# EAGLE design HabDroneSCHCO2 (EAGLE 8.3.1)
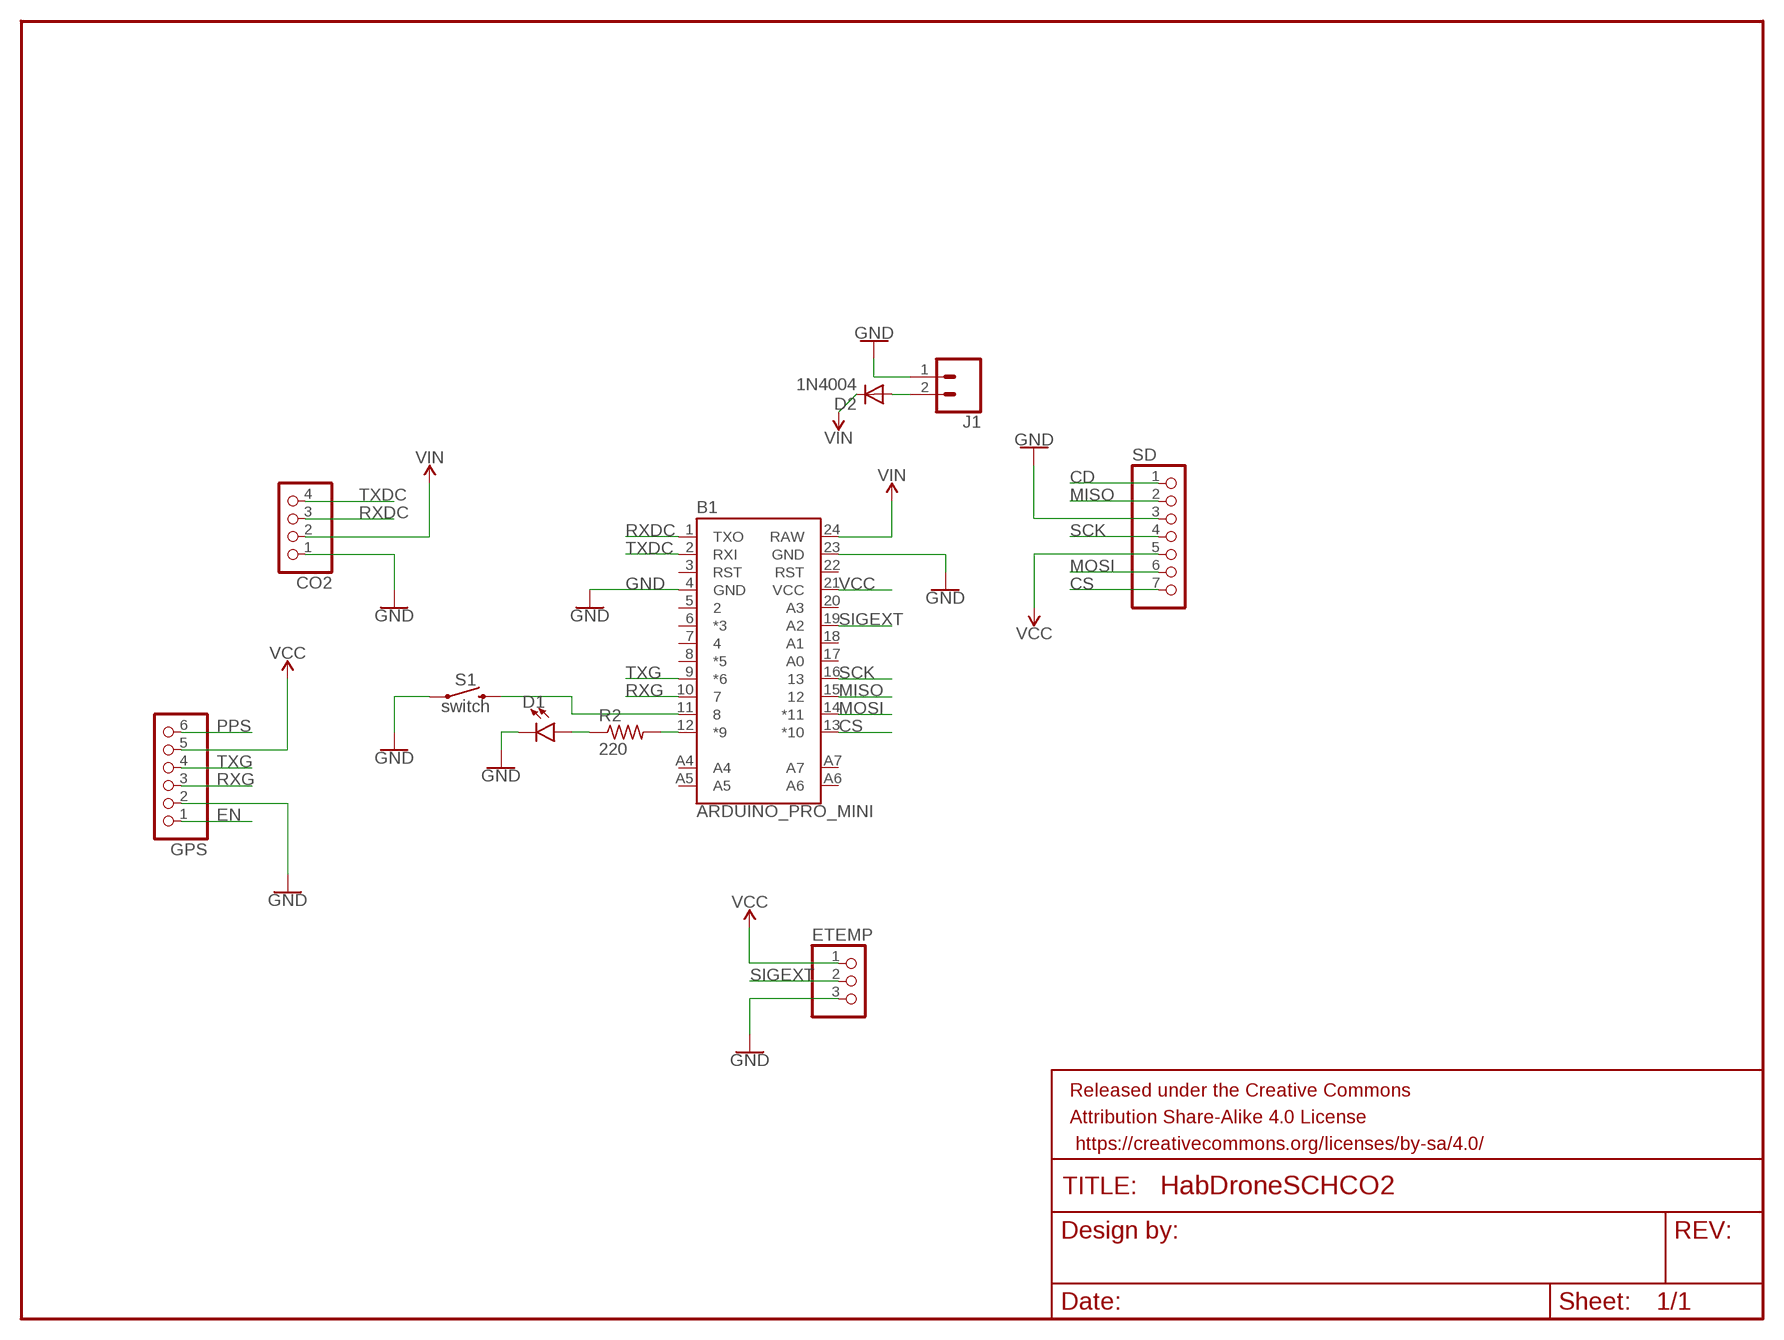
[diagram p0: schematic, sheet 1]

## Parts
B1  ARDUINO_PRO_MINI  [ARDUINO_PRO_MINI]
CO2  PINHD-1X4/90  [1X04/90]
D1  LED5MM  [LED_5MM]
D2  1N4004  [DO41-10]
ETEMP  PINHD-1X3/90  [1X03/90]
FRAME1  FRAME-LETTERNO_PACKAGE  [DUMMY]
GPS  PINHD-1X6/90  [1X06/90]
J1  CONN_025MM  [SCREWTERMINAL-5MM-2]
R2  220  R-US_VMTA55  [VMTA55]
S1  switch  MOMENTARY-SWITCH-SPST-PTH-6.0MM  [TACTILE_SWITCH_PTH_6.0MM]
SD  PINHD-1X7/90  [1X07/90]

## Nets
CD: SD.1
CS: B1.13(*10) SD.7
EN: GPS.1
GND: B1.4(GND) B1.23(GND) CO2.1 D1.K(C) ETEMP.3 GPS.2 J1.1 S1.1 SD.3
MISO: B1.15 SD.2
MOSI: B1.14(*11) SD.6
N$1: D2.A J1.2
N$2: B1.11 S1.3
N$5: B1.12(*9) R2.2
N$6: D1.A R2.1
PPS: GPS.6
RXDC: B1.1(TXO) CO2.3
RXG: B1.10 GPS.3
SCK: B1.16 SD.4
SIGEXT: B1.19(A2) ETEMP.2
TXDC: B1.2(RXI) CO2.4
TXG: B1.9(*6) GPS.4
VCC: B1.21(VCC) ETEMP.1 GPS.5 SD.5
VIN: B1.24(RAW) CO2.2 D2.C
Unconnected: B1.3(RST) B1.5 B1.6(*3) B1.7 B1.8(*5) B1.17(A0) B1.18(A1) B1.20(A3) B1.22(RST) B1.A4 B1.A5 B1.A6 B1.A7

## Library data of the parts
B1 = SparkFun-Boards:ARDUINO_PRO_MINI: SparkFun Pro Mini Pro Mini compatible footprint. Dimensions: 0.7 x 1.3" PCB Thickness: 0.8mm SparkFun Products: 3.3V/8MHz <https://www.sparkfun.com/products/11114> 5V/16MHz <https://www.sparkfun.com/products/11113>
CO2 = pinhead:PINHD-1X4: PIN HEADER
D1 = SparkFun-LED:LED: LED (Generic) Standard schematic elements and footprints for 5mm, 3mm, 1206, and 0603 sized LEDs. Generic LEDs with no color specified.
D2 = diode:1N4004: DIODE general purpose rectifier, 1 A
ETEMP = pinhead:PINHD-1X3: PIN HEADER
FRAME1 = SparkFun-Aesthetics:FRAME-LETTER: Schematic Frame - Letter Standard 8.5x11 US Letter frame; DESIGNER: Nobody; VERSION: v01
GPS = pinhead:PINHD-1X6: PIN HEADER
J1 = SparkFun-Retired:CONN_02: Multi connection point. Often used as Generic Header-pin footprint for 0.1 inch spaced/style header connections On any of the 0.1 inch spaced packages, you can populate with these: Break Away Headers - Straight <https://www.sparkfun.com/products/116> (PRT-00116) Break Away Male Headers - Right Angle <https://www.sparkfun.com/products/553> (PRT-00553) Female Headers <https://www.sparkfun.com/products/115> (PRT-00115) Break Away Headers - Machine Pin <https://www.sparkfun.com/products/117> (PRT-00117) Break Away Female Headers - Swiss Machine Pin <https://www.sparkfun.com/products/743> (PRT-00743) For SCREWTERMINALS and SPRING TERMINALS visit here: Screw Terimnals on SparkFun.com <https://www.sparkfun.com/search/results?term=Screw+Terminals> (5mm/3.5mm/2.54mm spacing) This device is also useful as a general connection point to wire up your design to another part of your project. Our various solder wires solder well into these plated through hole pads. Hook-Up Wire - Assortment (Stranded, 22 AWG) <https://www.sparkfun.com/products/11375> (PRT-11375) Hook-Up Wire - Assortment (Solid Core, 22 AWG) <https://www.sparkfun.com/products/11367> (PRT-11367) View the entire wire category on our website here <https://www.sparkfun.com/categories/141> Special notes: Molex polarized connector foot print use with: PRT-08233 with associated crimp pins and housings. 2.54_SCREWTERM for use with PRT-10571. 3.5mm Screw Terminal footprints for PRT-08084 5mm Screw Terminal footprints for use with PRT-08432; SF_SKU: PRT-08432
R2 = rcl:R-US_: RESISTOR, American symbol
S1 = SparkFun-Switches:MOMENTARY-SWITCH-SPST: Momentary Switch (Pushbutton) - SPST Normally-open (NO) SPST momentary switches (buttons, pushbuttons). Variants PTH-12MM - 12mm square, through-hole Momentary Pushbutton Switch - 12mm Square <https://www.sparkfun.com/products/9190> (COM-09190) PTH-6.0MM, PTH-6.0MM-KIT - 6.0mm square, through-hole Mini Pushbutton Switch <https://www.sparkfun.com/products/97> (COM-00097) KIT package intended for soldering kit's - only one side of pads' copper is exposed. PTH-RIGHT-ANGLE-KIT - Right-angle, through-hole Right Angle Tactile Button <https://www.sparkfun.com/products/10791> - Used on SparkFun BigTime Watch Kit <https://www.sparkfun.com/products/11734> SMD-12MM - 12mm square, surface-mount Tactile Button - SMD (12mm) <https://www.sparkfun.com/products/12993> (COM-12993) Used on SparkFun PicoBoard <https://www.sparkfun.com/products/11888> SMD-4.5MM - 4.5mm Square Trackball Switch Used on SparkFun Blackberry Trackballer Breakout <https://www.sparkfun.com/products/13169> SMD-4.6MMX2.8MM - 4.60mm x 2.80mm, surface mount Used on SparkFun SAMD21 Mini Breakout <https://www.sparkfun.com/products/13664> SMD-5.2MM, SMD-5.2-REDUNDANT - 5.2mm square, surface-mount Mini Pushbutton Switch - SMD <https://www.sparkfun.com/products/8720> (COM-08720) Used on Arduino Pro Mini <https://www.sparkfun.com/products/11114> REDUNDANT package connects both switch circuits together SMD-6.0X3.5MM - 6.0 x 3.5mm, surface mount Momentary Reset Switch SMD <https://www.sparkfun.com/products/8229> (COM-08229) SMD-6.2MM-TALL - 6.2mm square, surface mount Tactile Button - SMD (6mm) <https://www.sparkfun.com/products/12992> Used on SparkFun Digital Sandbox <https://www.sparkfun.com/products/12651> SMD-RIGHT-ANGLE - Right-angle, surface mount Used on SparkFun Block for Intel® Edison - Arduino <https://www.sparkfun.com/products/13036>; PROD_ID: SWCH-08441; SF_SKU: COM-00097
SD = pinhead:PINHD-1X7: PIN HEADER

## Board
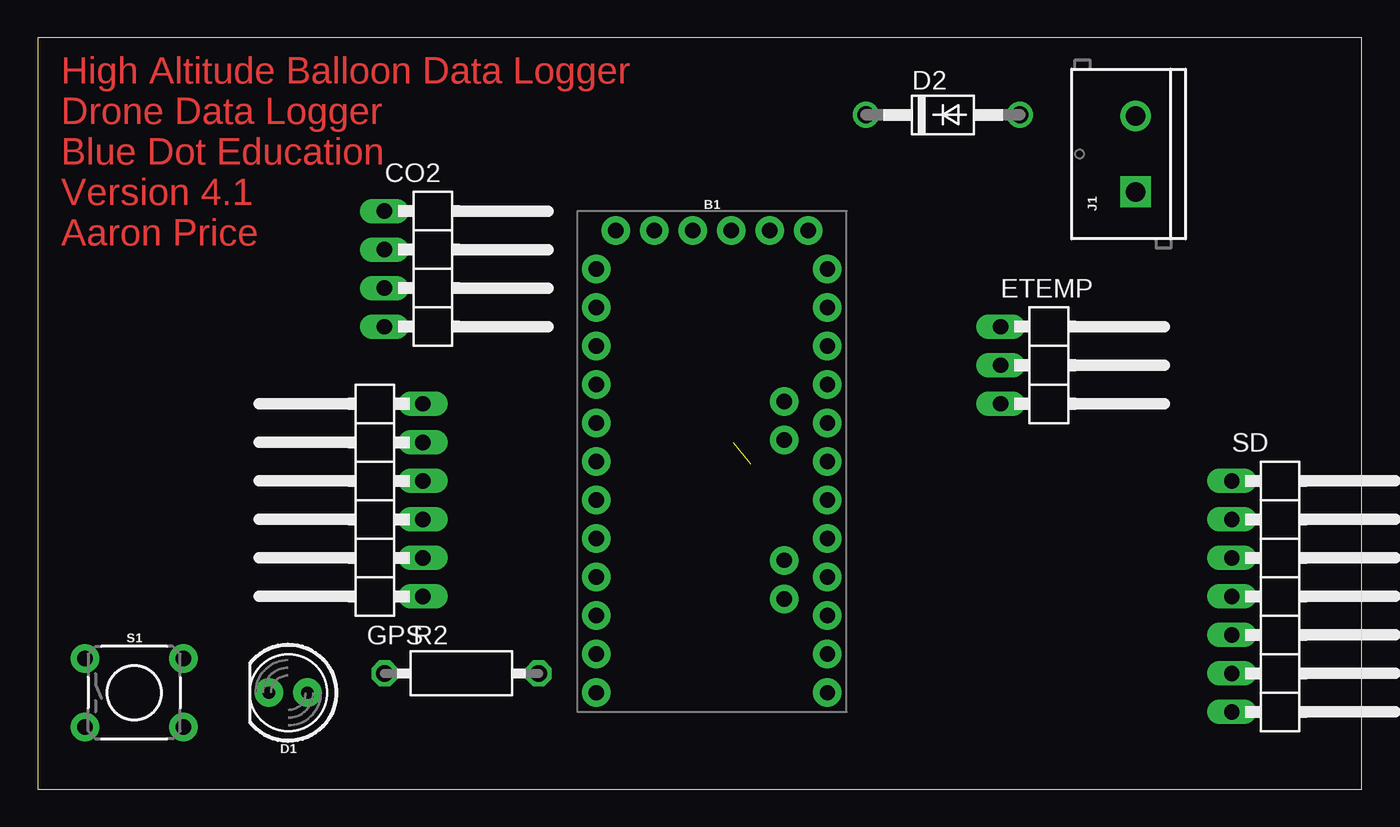
[diagram p1: board, top side]
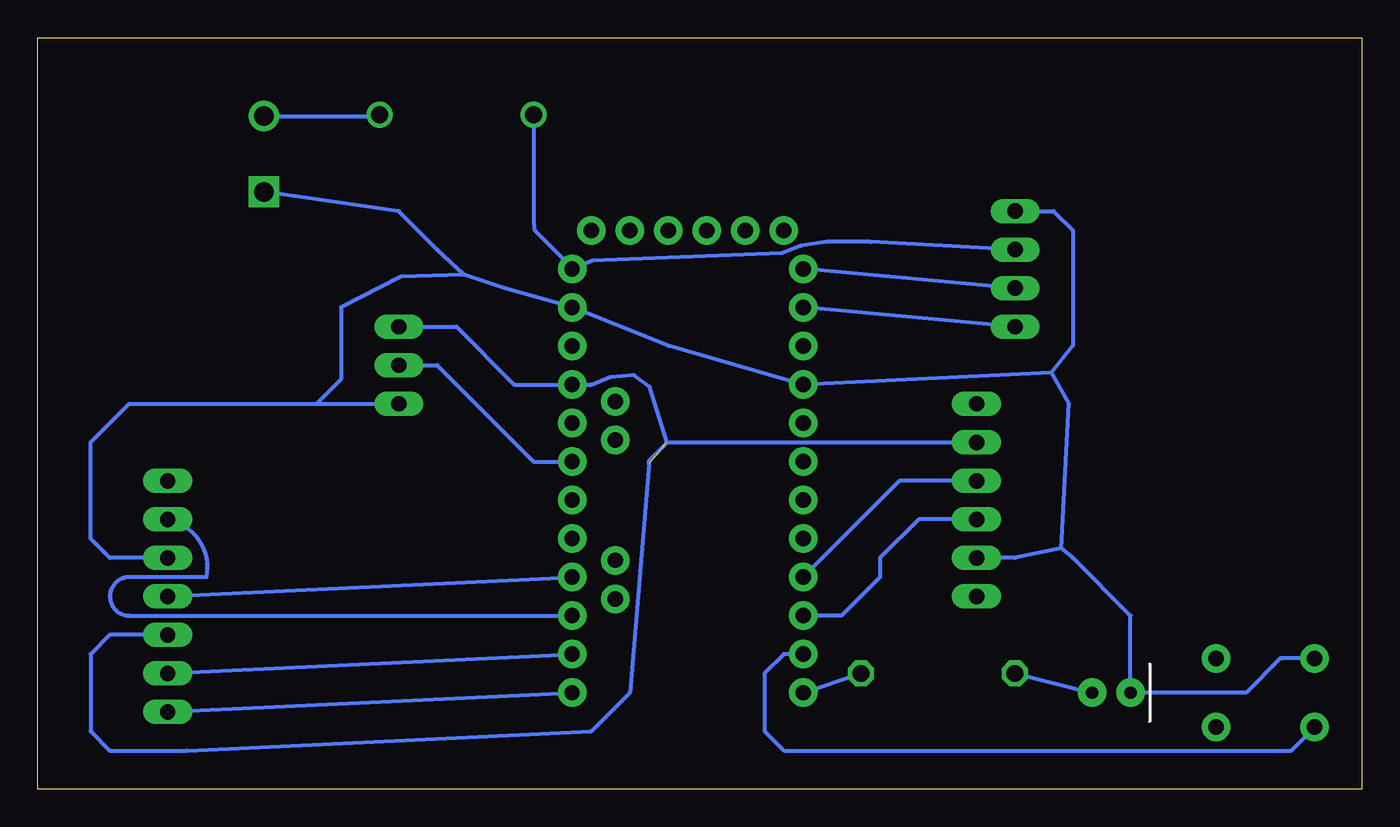
[diagram p2: board, bottom side, seen from below]

Size 87.3 x 49.52 mm. Coordinates in mm from the lower left corner, seen from the top.
Outline: 0,0 87.3,0 87.3,49.52 0,49.52 0,0
Copper layers (1*16): Top 0.035mm / dielectric 1.5mm / Bottom 0.035mm
Design rules "SparkFun": minimum track width 8mil, minimum drill 20mil, track to track 8mil, track to pad 8mil, pad to pad 8mil, via to via 8mil, smd to smd 8mil, copper to edge 8mil, drill to drill 8mil, minimum pad ring 12mil, minimum via ring 10mil, stop-mask expansion 4mil, vias tented up to drill 20mil, thermal gap 10mil

### Footprints (pad centres in the part's own frame; a part is rotated, then mirrored left to right if it is on the bottom)
ARDUINO_PRO_MINI = drill 1.016 pad 1.88: 1 -7.62,12.7; 2 -7.62,10.16; 3 -7.62,7.62; 4 -7.62,5.08; 5 -7.62,2.54; 6 -7.62,0; 7 -7.62,-2.54; 8 -7.62,-5.08; 9 -7.62,-7.62; 10 -7.62,-10.16; 11 -7.62,-12.7; 12 -7.62,-15.24; 13 7.62,-15.24; 14 7.62,-12.7; 15 7.62,-10.16; 16 7.62,-7.62; 17 7.62,-5.08; 18 7.62,-2.54; 19 7.62,0; 20 7.62,2.54; 21 7.62,5.08; 22 7.62,7.62; 23 7.62,10.16; 24 7.62,12.7; A4 4.763,1.429; A5 4.763,3.969; A6 4.763,-9.049; A7 4.763,-6.509; BLK -6.35,15.24; GND -3.81,15.24; GRN 6.35,15.24; RXI 1.27,15.24; TXO 3.81,15.24; VCC -1.27,15.24
1X04/90 = drill 1.016 long: 1 -3.81,-3.81; 2 -1.27,-3.81; 3 1.27,-3.81; 4 3.81,-3.81
LED_5MM = drill 0.813 pad 1.88: A -1.27,0; K 1.27,0
DO41-10 = drill 1.118: A 5.08,0; C -5.08,0
1X03/90 = drill 1.016 long: 1 -2.54,-3.81; 2 0,-3.81; 3 2.54,-3.81
1X06/90 = drill 1.016 long: 1 -6.35,-3.81; 2 -3.81,-3.81; 3 -1.27,-3.81; 4 1.27,-3.81; 5 3.81,-3.81; 6 6.35,-3.81
SCREWTERMINAL-5MM-2 = drill 1.3 pad 2.032 square: 1 0,0 | drill 1.3 pad 2.032: 2 5,0
VMTA55 = drill 1.1 octagon: 1 -5.08,0; 2 5.08,0
TACTILE_SWITCH_PTH_6.0MM = drill 1.016 pad 1.88: 1 -3.251,2.261; 2 3.251,2.261; 3 -3.251,-2.261; 4 3.251,-2.261
1X07/90 = drill 1.016 long: 1 -7.62,-3.81; 2 -5.08,-3.81; 3 -2.54,-3.81; 4 0,-3.81; 5 2.54,-3.81; 6 5.08,-3.81; 7 7.62,-3.81

### Placement (x,y rotation side)
B1  44.45,21.59 0 top
CO2  26.67,34.29 270 top
D1  16.51,6.35 180 top
D2  59.69,44.45 0 top
ETEMP  67.31,27.94 270 top
FRAME1  -55.88,31.75 0 top  (outside the outline)
GPS  21.59,19.05 90 top
J1  72.39,39.37 90 top
R2  27.94,7.62 0 top
S1  6.35,6.35 0 top
SD  82.55,12.7 270 top

### Tracks (layer width: path | path; a pad name or v marks a point on that pad's centre or on a via)
CS
  Bottom 0.254: SD.7 B1.13
GND
  Bottom 0.254: 20.45,27.43 19.05,29.21 19.05,36.83 20.32,38.1 CO2.1 | 20.45,27.43 B1.4 45.72,29.21 B1.23 56.52,33.02 59.18,33.91 | SD.3 82.55,15.24 83.82,16.51 83.82,22.86 81.28,25.4 68.92,25.4 | 68.92,25.4 ETEMP.3 | 59.18,33.91 63.37,33.78 67.31,31.75 67.31,27.01 68.92,25.4 | 19.8,15.86 19.05,15.24 15.24,11.43 D1.K 7.62,6.35 5.36,8.61 S1.1 | 19.8,15.86 19.81,15.87 19.3,25.4 20.45,27.43 | 59.18,33.91 60.96,35.56 63.5,38.1 J1.1 | 19.8,15.86 22.86,15.24 GPS.2
MISO
  Bottom 0.254: SD.2 arc90 76.2,13.97 81.28,13.97 arc-90 82.55,12.7 arc-90 81.28,11.43 B1.15
MOSI
  Bottom 0.254: SD.6 B1.14
N$1
  Bottom 0.254: J1.2 64.85,44.37 D2.A
N$2
  Bottom 0.254: B1.11 38.1,8.89 39.37,7.62 39.37,3.81 38.1,2.54 4.65,2.54 S1.3
N$5
  Bottom 0.254: B1.12 R2.2
N$6
  Bottom 0.254: R2.1 D1.A
RXDC
  Bottom 0.254: CO2.3 B1.1
RXG
  Bottom 0.254: GPS.3 29.21,17.78 31.75,15.24 31.75,13.97 34.29,11.43 B1.10
SCK
  Bottom 0.254: SD.4 B1.16
SIGEXT
  Bottom 0.254: ETEMP.2 60.96,27.94 54.61,21.59 B1.19
TXDC
  Bottom 0.254: CO2.4 B1.2
TXG
  Bottom 0.254: B1.9 30.48,20.32 GPS.4
VCC  (1 unrouted)
  Bottom 0.254: GPS.5 45.78,22.86 46.99,21.65 47.01,21.43 48.26,6.35 50.8,3.81 77.47,2.54 82.55,2.54 83.82,3.81 83.82,8.89 82.55,10.16 SD.5 | ETEMP.1 59.69,30.48 55.88,26.67 B1.21 50.8,26.67 49.53,27.18 48.01,27.3 46.99,26.54 45.85,22.85
VIN
  Bottom 0.254: 52.02,34.31 50.78,34.82 38.22,35.33 36.97,35.81 35.31,36.07 32.39,36.07 CO2.2 | 52.02,34.31 B1.24 | D2.C 54.61,37.34 54.53,36.83 52.02,34.31

### Text on the board
Top: High Altitude Balloon Data Logger / Drone Data Logger / Blue Dot Education / Version 4.1 / Aaron Price